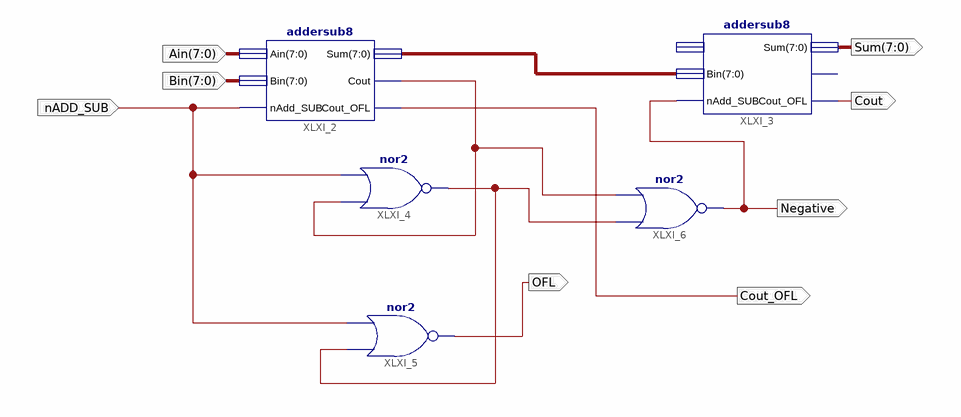
[diagram p0: schematic sheet 1]
// Xilinx ISE schematic Full_AdderSub8.sch (spartan3e) as structural Verilog: 5 symbols, 8 ports
module Full_AdderSub8 (
  input  [7:0] Ain,
  input  [7:0] Bin,
  input  nADD_SUB,
  output Cout,
  output [7:0] Sum,
  output Negative,
  output OFL,
  output Cout_OFL
);

  wire XLXN_12, XLXN_17;
  wire [7:0] XLXN_1;

  addersub8 XLXI_2 (.Ain(Ain), .Bin(Bin), .nAdd_SUB(nADD_SUB), .Sum(XLXN_1), .Cout(XLXN_17), .Cout_OFL(Cout_OFL));
  addersub8 XLXI_3 (.Bin(XLXN_1), .nAdd_SUB(Negative), .Sum(Sum), .Cout_OFL(Cout));  // open: Ain, Cout
  nor XLXI_4 (XLXN_12, XLXN_17, nADD_SUB);
  nor XLXI_5 (OFL, XLXN_12, nADD_SUB);
  nor XLXI_6 (Negative, XLXN_12, XLXN_17);
endmodule
